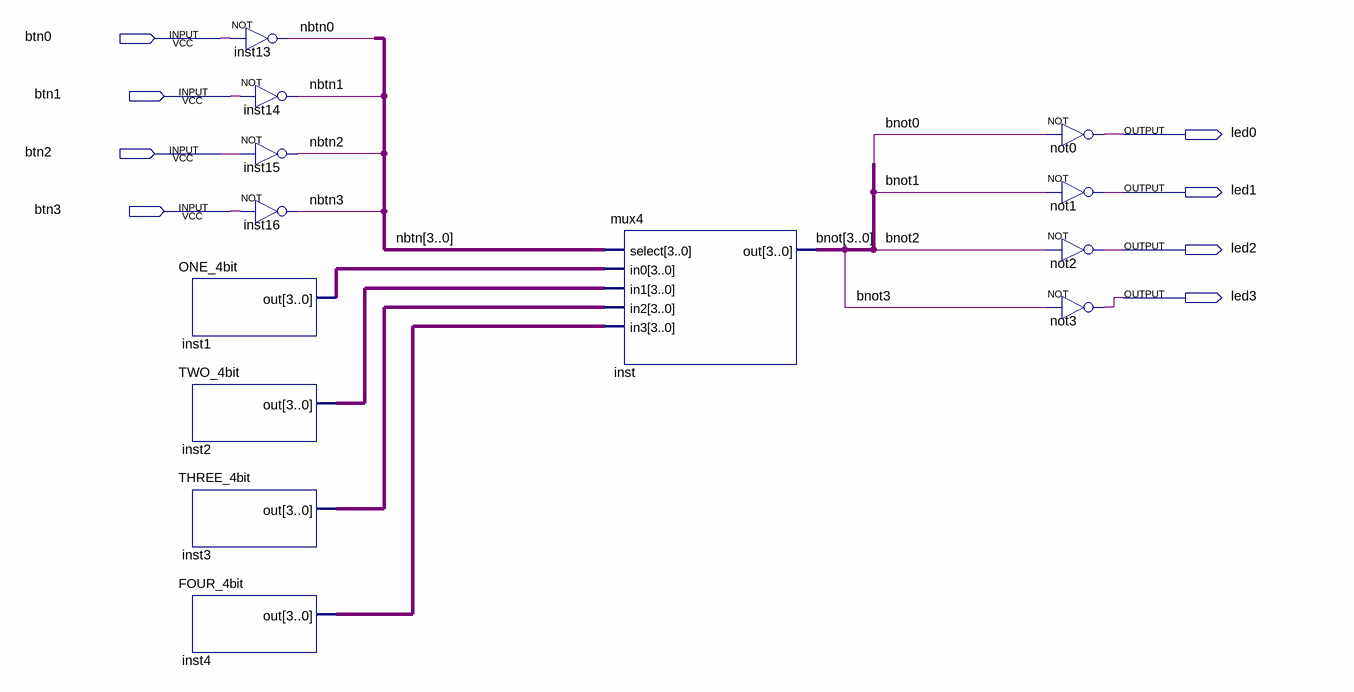
[diagram p0: schematic sheet]
// Quartus schematic test_mux4.bdf as structural Verilog: 13 symbols, 8 pins
module test_mux4 (
  input  btn0,
  input  btn1,
  input  btn2,
  input  btn3,
  output led0,
  output led1,
  output led2,
  output led3
);

  wire [3:0] bnot, inst1_out, inst2_out, inst3_out, inst4_out, nbtn;

  ONE_4bit inst1 (.out(inst1_out));
  TWO_4bit inst2 (.out(inst2_out));
  THREE_4bit inst3 (.out(inst3_out));
  FOUR_4bit inst4 (.out(inst4_out));
  not inst13 (nbtn[0], btn0);
  not inst14 (nbtn[1], btn1);
  not inst15 (nbtn[2], btn2);
  not inst16 (nbtn[3], btn3);
  mux4 inst (.select(nbtn), .in0(inst1_out), .in1(inst2_out), .in2(inst3_out), .in3(inst4_out), .out(bnot));
  not not0 (led0, bnot[0]);
  not not1 (led1, bnot[1]);
  not not2 (led2, bnot[2]);
  not not3 (led3, bnot[3]);
endmodule
